# Altium project USBBridge3150.PrjPcb
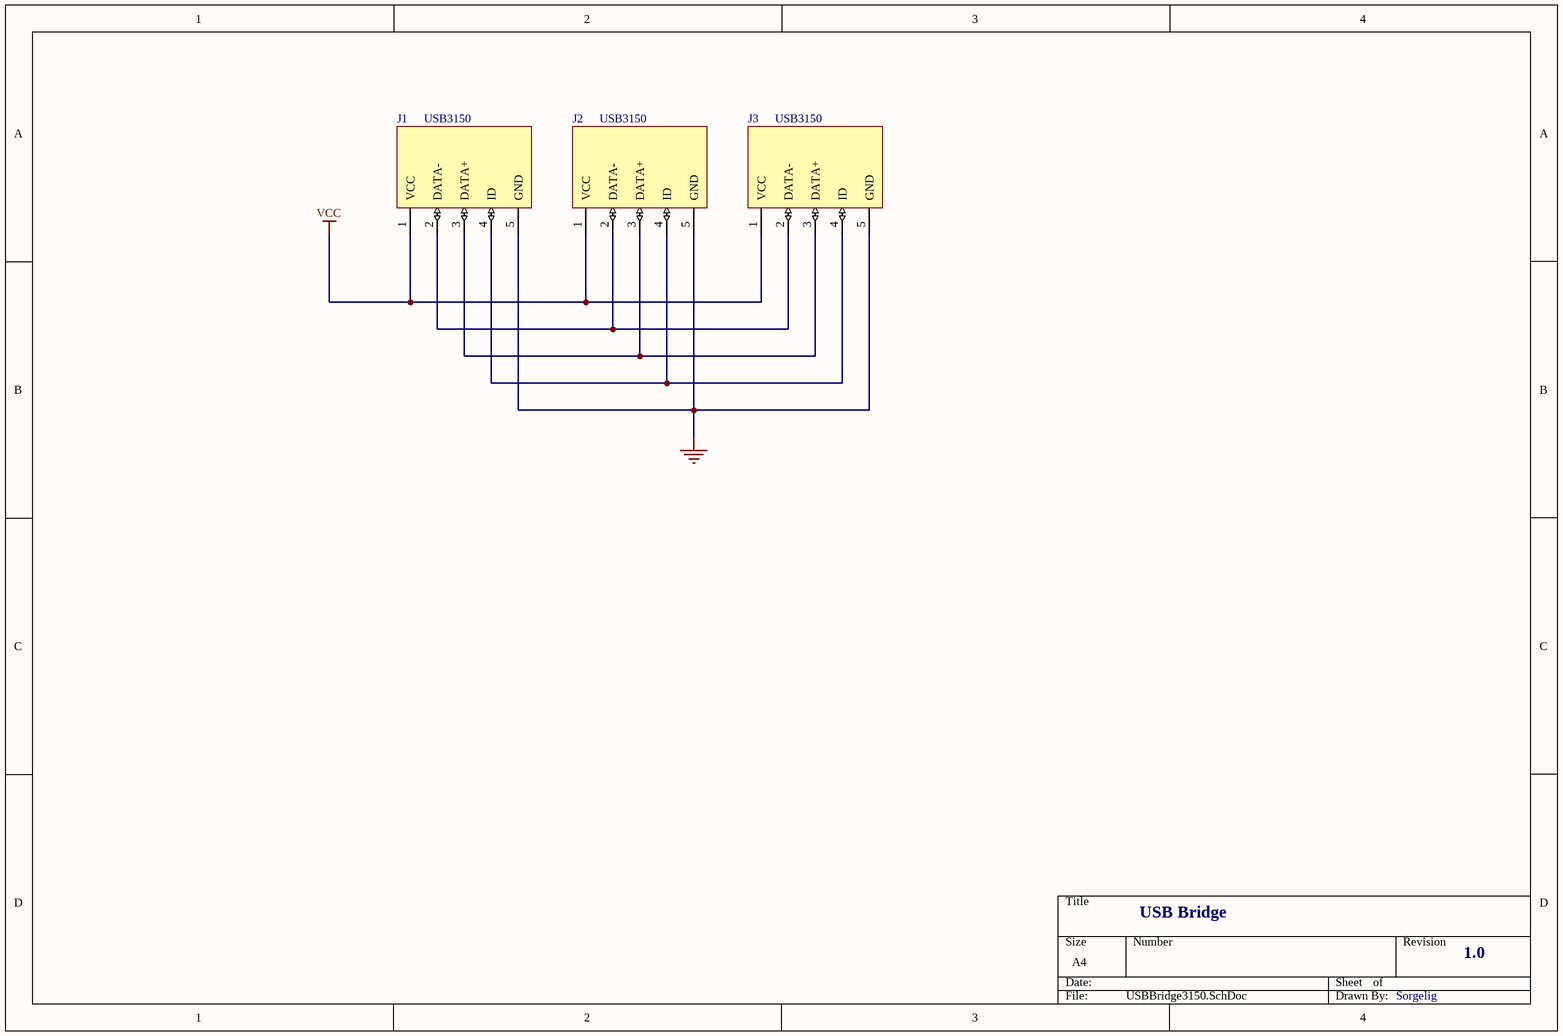
[diagram p0: USBBridge3150.SchDoc]
1 sheet, 3 parts. Net scope: global (net labels, ports and power ports of the same name join across sheets).
Board file: USBBridge3150.PcbDoc

## Sheet USBBridge3150.SchDoc
size A4

### Parts
J1  USB3150  [USB3150]
J2  USB3150  [USB3150]
J3  USB3150  [USB3150]

### Nets
GND: J1.5(GND) J2.5(GND) J3.5(GND)
VCC: J1.1(VCC) J2.1(VCC) J3.1(VCC)
NetJ1_2: J1.2(DATA-) J2.2(DATA-) J3.2(DATA-)
NetJ1_3: J1.3(DATA+) J2.3(DATA+) J3.3(DATA+)
NetJ1_4: J1.4(ID) J2.4(ID) J3.4(ID)

### Notes on the sheet
- USB Bridge
- 1.0
- Sorgelig

### Library data of the parts
J1-J3 = USB3150-XX-XXX-X_revA: Micro USB Plug, Type B, Through-Hole, Vertical,  with Shell Stakes, with Locating Pegs